# Altium project mcu.PrjPcb (part 1 of 2)
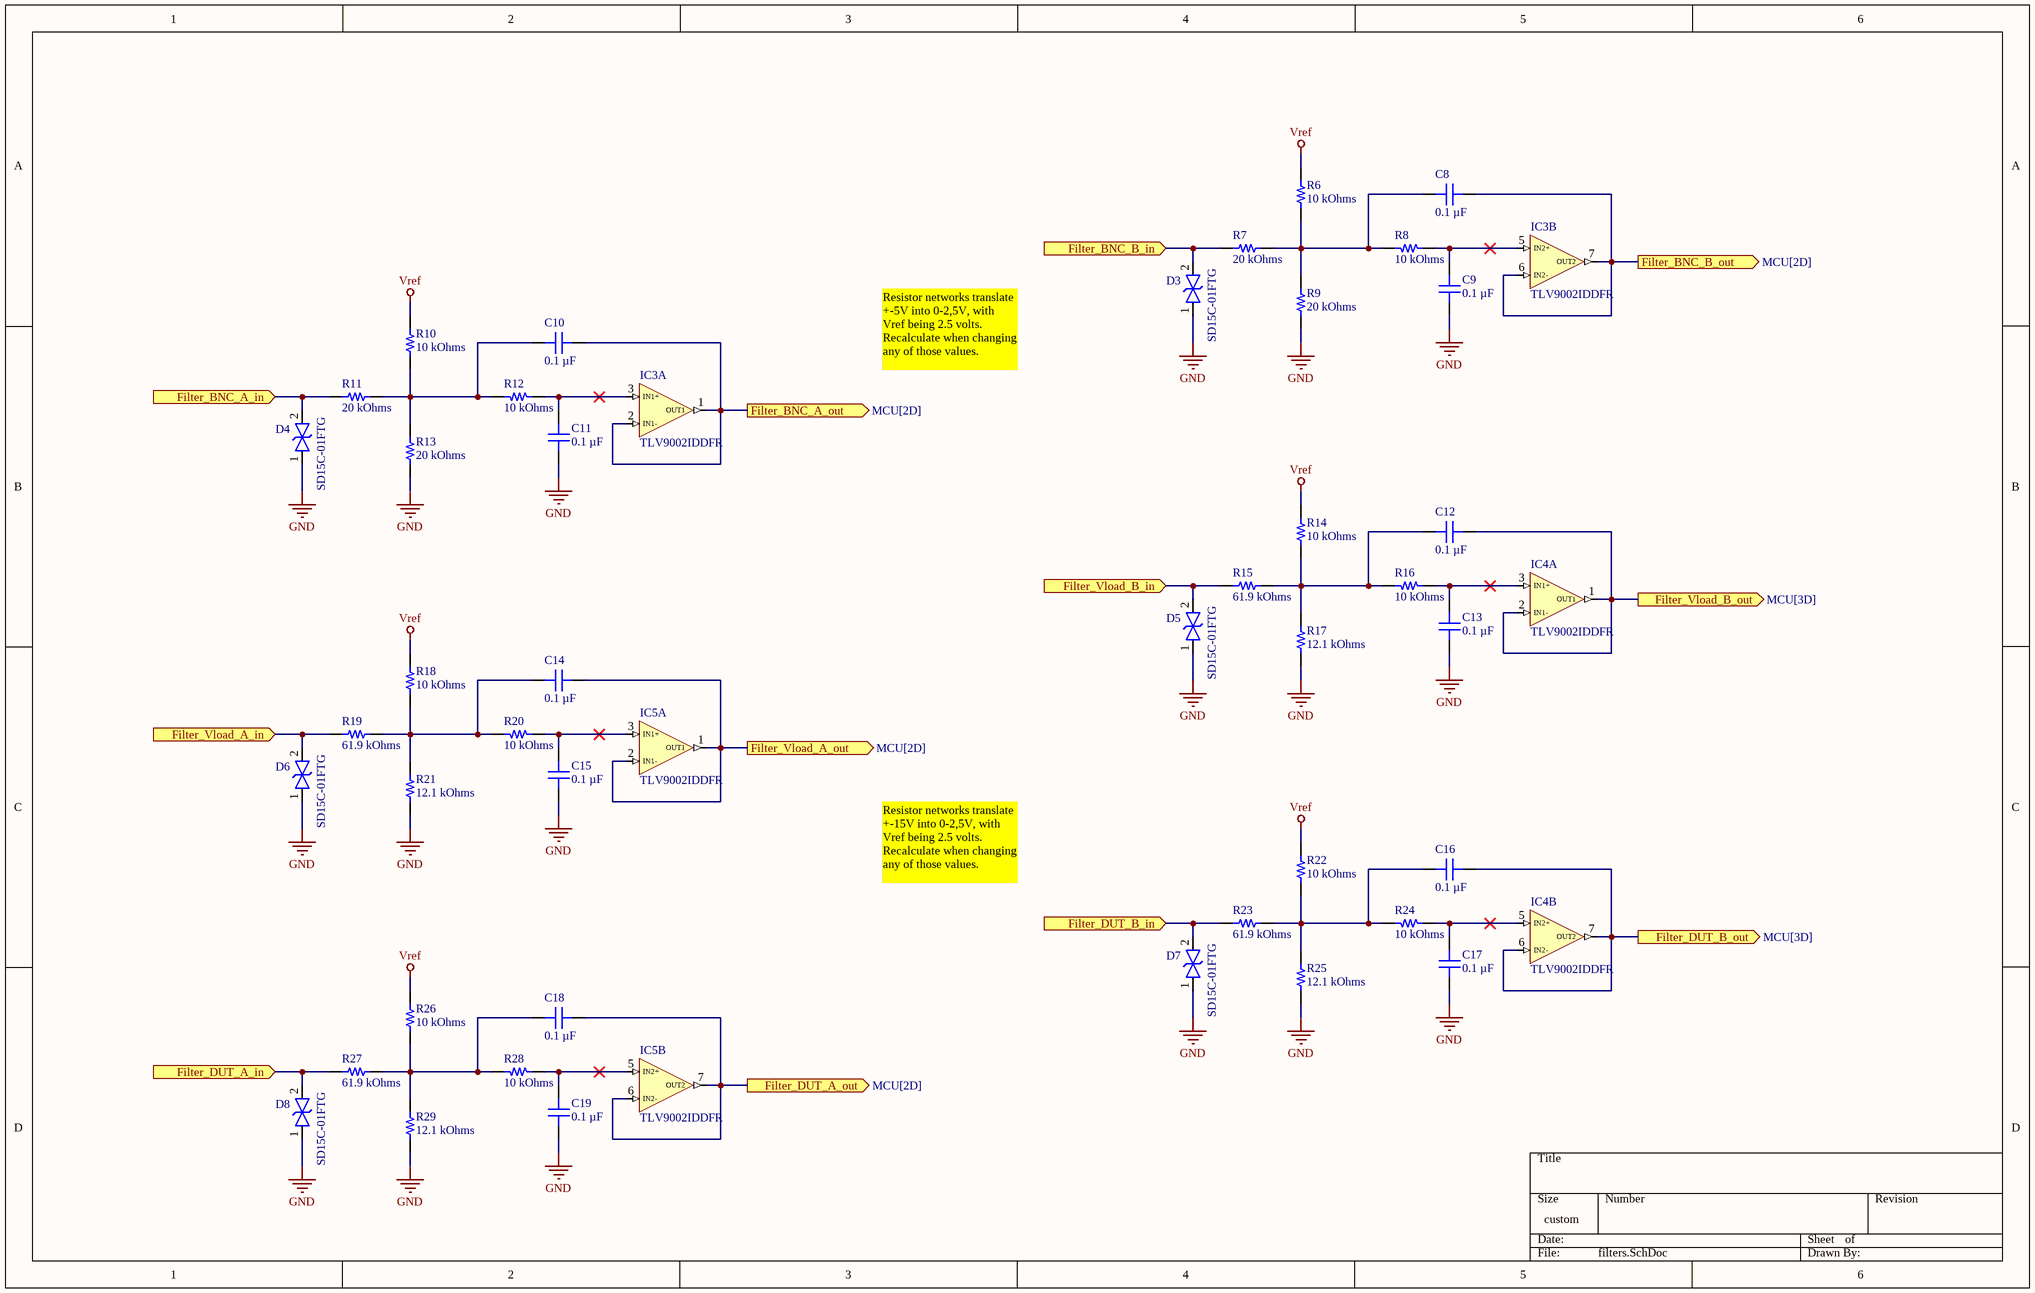
[diagram p0: filters.SchDoc]
5 sheets, 140 parts. Net scope: flat (ports and power ports of the same name join across sheets).
Board file: mcu.PcbDoc
Sheets:
  filters.SchDoc
  power.SchDoc
  MCU.SchDoc
  misc.SchDoc
  LCD.SchDoc

## Sheet filters.SchDoc
size 381 x 241 mm; SheetNumber: 1; SheetTotal: 5

### Parts
C8  0.1 µF  [CAP 1206_3216 - 0.8MM]
C9  0.1 µF  [CAP 1206_3216 - 0.8MM]
C10  0.1 µF  [CAP 1206_3216 - 0.8MM]
C11  0.1 µF  [CAP 1206_3216 - 0.8MM]
C12  0.1 µF  [CAP 1206_3216 - 0.8MM]
C13  0.1 µF  [CAP 1206_3216 - 0.8MM]
C14  0.1 µF  [CAP 1206_3216 - 0.8MM]
C15  0.1 µF  [CAP 1206_3216 - 0.8MM]
C16  0.1 µF  [CAP 1206_3216 - 0.8MM]
C17  0.1 µF  [CAP 1206_3216 - 0.8MM]
C18  0.1 µF  [CAP 1206_3216 - 0.8MM]
C19  0.1 µF  [CAP 1206_3216 - 0.8MM]
D3  SD15C-01FTG  [SD15C01FTG]
D4  SD15C-01FTG  [SD15C01FTG]
D5  SD15C-01FTG  [SD15C01FTG]
D6  SD15C-01FTG  [SD15C01FTG]
D7  SD15C-01FTG  [SD15C01FTG]
D8  SD15C-01FTG  [SD15C01FTG]
IC3  TLV9002IDDFR  [SOT65P280X110-8N]  (parts A,B of 3)
IC4  TLV9002IDDFR  [SOT65P280X110-8N]  (parts A,B of 3)
IC5  TLV9002IDDFR  [SOT65P280X110-8N]  (parts A,B of 3)
R6  10 kOhms  [RES 1206_3216]
R7  20 kOhms  [RES 1206_3216]
R8  10 kOhms  [YAGEO RES 1206_3216]
R9  20 kOhms  [RES 1206_3216]
R10  10 kOhms  [RES 1206_3216]
R11  20 kOhms  [RES 1206_3216]
R12  10 kOhms  [YAGEO RES 1206_3216]
R13  20 kOhms  [RES 1206_3216]
R14  10 kOhms  [RES 1206_3216]
R15  61.9 kOhms  [RES 1206_3216]
R16  10 kOhms  [YAGEO RES 1206_3216]
R17  12.1 kOhms  [RES 1206_3216]
R18  10 kOhms  [RES 1206_3216]
R19  61.9 kOhms  [RES 1206_3216]
R20  10 kOhms  [YAGEO RES 1206_3216]
R21  12.1 kOhms  [RES 1206_3216]
R22  10 kOhms  [RES 1206_3216]
R23  61.9 kOhms  [RES 1206_3216]
R24  10 kOhms  [YAGEO RES 1206_3216]
R25  12.1 kOhms  [RES 1206_3216]
R26  10 kOhms  [RES 1206_3216]
R27  61.9 kOhms  [RES 1206_3216]
R28  10 kOhms  [YAGEO RES 1206_3216]
R29  12.1 kOhms  [RES 1206_3216]

### Ports
Filter_BNC_A_in (in), Filter_BNC_A_out (out, see MCU[2D]), Filter_BNC_B_in (in), Filter_BNC_B_out (out, see MCU[2D]), Filter_DUT_A_in (in), Filter_DUT_A_out (out, see MCU[2D]), Filter_DUT_B_in (in), Filter_DUT_B_out (out, see MCU[3D]), Filter_Vload_A_in (in), Filter_Vload_A_out (out, see MCU[2D]), Filter_Vload_B_in (in), Filter_Vload_B_out (out, see MCU[3D])

### Nets
GND: C9.2 C11.2 C13.2 C15.2 C17.2 C19.2 D3.1 D4.1 D5.1 D6.1 D7.1 D8.1 R9.2 R13.2 R17.2 R21.2 R25.2 R29.2
Vref: R6.1 R10.1 R14.1 R18.1 R22.1 R26.1
NetC8_1: C8.1 IC3.6(IN2-) IC3.7(OUT2) ; port Filter_BNC_B_out
NetC8_2: C8.2 R6.2 R7.2 R8.2 R9.1
NetC9_1: C9.1 IC3.5(IN2+) R8.1
NetC10_1: C10.1 IC3.1(OUT1) IC3.2(IN1-) ; port Filter_BNC_A_out
NetC10_2: C10.2 R10.2 R11.2 R12.2 R13.1
NetC11_1: C11.1 IC3.3(IN1+) R12.1
NetC12_1: C12.1 IC4.1(OUT1) IC4.2(IN1-) ; port Filter_Vload_B_out
NetC12_2: C12.2 R14.2 R15.2 R16.2 R17.1
NetC13_1: C13.1 IC4.3(IN1+) R16.1
NetC14_1: C14.1 IC5.1(OUT1) IC5.2(IN1-) ; port Filter_Vload_A_out
NetC14_2: C14.2 R18.2 R19.2 R20.2 R21.1
NetC15_1: C15.1 IC5.3(IN1+) R20.1
NetC16_1: C16.1 IC4.6(IN2-) IC4.7(OUT2) ; port Filter_DUT_B_out
NetC16_2: C16.2 R22.2 R23.2 R24.2 R25.1
NetC17_1: C17.1 IC4.5(IN2+) R24.1
NetC18_1: C18.1 IC5.6(IN2-) IC5.7(OUT2) ; port Filter_DUT_A_out
NetC18_2: C18.2 R26.2 R27.2 R28.2 R29.1
NetC19_1: C19.1 IC5.5(IN2+) R28.1
NetD3_2: D3.2 R7.1 ; port Filter_BNC_B_in
NetD4_2: D4.2 R11.1 ; port Filter_BNC_A_in
NetD5_2: D5.2 R15.1 ; port Filter_Vload_B_in
NetD6_2: D6.2 R19.1 ; port Filter_Vload_A_in
NetD7_2: D7.2 R23.1 ; port Filter_DUT_B_in
NetD8_2: D8.2 R27.1 ; port Filter_DUT_A_in

### Notes on the sheet
- Resistor networks translate +-5V into 0-2,5V, with Vref being 2.5 volts. Recalculate when changing any of those values.
- Resistor networks translate +-15V into 0-2,5V, with Vref being 2.5 volts. Recalculate when changing any of those values.

### Library data of the parts
C8-C19 = 885012208087: CAP CER 0.1UF 50V X7R 1206; manufacturer: Würth Elektronik; Tolerance: ±10%; Part Number: 885012208087; Capacitance: 0.1 µF; Applications: General Purpose; componentlink1description: Datasheet; componentlink1url: https://katalog.we-online.de/pbs/datasheet/885012208087.pdf; componentlink2description: DigiKey Link; componentlink2url: https://www.digikey.com/en/products/detail/würth-elektronik/885012208087/5453982; Device Package: 1206 (3216 Metric); lastupdated: 6/4/2024 19:10:27; Lifecycle Status: Active; Minimum Order: 1; Mounting Type: Surface Mount, MLCC; Operating Temperature: -55°C ~ 125°C; Package / Case: 1206 (3216 Metric); packaging: TapeAndReel; partid: 20879; Part Status: Active; price: 0.06; series: WCAP-CSGP; Size / Dimension: 0.126" L x 0.063" W (3.20mm x 1.60mm); Supplier 1: DigiKey; Supplier Part Number 1: 732-8127-1-ND; Temperature Coefficient: X7R; Thickness (Max): 0.035" (0.90mm); value: 0.1 µF; Voltage - Rated: 50V
D3-D8 = SD15C-01FTG: TVS Diode (Bi-directional); Manufacturer_Name: LITTELFUSE; Datasheet Link: https://www.arrow.com/en/products/sd15c-01ftg/littelfuse; Height: 1.14mm; Manufacturer_Part_Number: SD15C-01FTG; Mouser Part Number: 576-SD15C-01FTG; Mouser Price/Stock: https://www.mouser.co.uk/ProductDetail/Littelfuse/SD15C-01FTG?qs=4zl93aaztU8pjSvpxpJP6g%3D%3D; Arrow Part Number: SD15C-01FTG; Arrow Price/Stock: https://www.arrow.com/en/products/sd15c-01ftg/littelfuse?region=nac
IC3-IC5 = TLV9002IDDFR: Integrated Circuit; Manufacturer_Name: Texas Instruments; Datasheet Link: https://www.ti.com/lit/gpn/TLV9002; Height: 1.1mm; Manufacturer_Part_Number: TLV9002IDDFR; Mouser Part Number: 595-TLV9002IDDFR; Mouser Price/Stock: https://www.mouser.co.uk/ProductDetail/Texas-Instruments/TLV9002IDDFR?qs=mAH9sUMRCtuVJ6NmNV%252Bgrw%3D%3D; Arrow Part Number: TLV9002IDDFR; Arrow Price/Stock: https://www.arrow.com/en/products/tlv9002iddfr/texas-instruments?utm_currency=USD&region=nac
R6 R10 R14 R18 R22 R26 = ERA-8AEB103V: RES SMD 10K OHM 0.1% 1/4W 1206; Manufacturer: Panasonic Electronic Components; Power (Watts): 0.25W, 1/4W; Temperature Coefficient: ±25ppm/°C; Part Number: ERA-8AEB103V; ComponentLink1Description: Datasheet; ComponentLink1URL: https://industrial.panasonic.com/cdbs/www-data/pdf/RDM0000/AOA0000C307.pdf; ComponentLink2Description: DigiKey Link; ComponentLink2URL: https://www.digikey.com/en/products/detail/panasonic-electronic-components/ERA-8AEB103V/3070742; Composition: Thin Film; Device Package: 1206 (3216 Metric); Features: Automotive AEC-Q200; Height - Seated (Max): 0.028" (0.70mm); LastUpdated: 2/9/2024 20:54:17; Lifecycle Status: Active; Minimum Order: 1; Number of Terminations: 2; Operating Temperature: -55°C ~ 155°C; Package / Case: 1206 (3216 Metric); Packaging: TapeAndReel; PartId: 33990; Part Status: Active; Price: 0.10; Ratings: AEC-Q200; Resistance: 10 kOhms; Series: ERA-8A; Size / Dimension: 0.126" L x 0.063" W (3.20mm x 1.60mm); Supplier 1: DigiKey; Supplier Part Number 1: P10KBCCT-ND; Supplier Device Package: 1206; Tolerance: ±0.1%; Value: 10 kOhms
R7 R9 R11 R13 = ERA-8AEB203V: RES SMD 20K OHM 0.1% 1/4W 1206; Manufacturer: Panasonic Electronic Components; Power (Watts): 0.25W, 1/4W; Temperature Coefficient: ±25ppm/°C; Part Number: ERA-8AEB203V; ComponentLink1Description: Datasheet; ComponentLink1URL: https://industrial.panasonic.com/cdbs/www-data/pdf/RDM0000/AOA0000C307.pdf; ComponentLink2Description: DigiKey Link; ComponentLink2URL: https://www.digikey.com/en/products/detail/panasonic-electronic-components/ERA-8AEB203V/3070867; Composition: Thin Film; Device Package: 1206 (3216 Metric); Features: Automotive AEC-Q200; Height - Seated (Max): 0.028" (0.70mm); LastUpdated: 2/9/2024 20:54:17; Lifecycle Status: Active; Minimum Order: 1; Number of Terminations: 2; Operating Temperature: -55°C ~ 155°C; Package / Case: 1206 (3216 Metric); Packaging: TapeAndReel; PartId: 33988; Part Status: Active; Price: 0.10; Ratings: AEC-Q200; Resistance: 20 kOhms; Series: ERA-8A; Size / Dimension: 0.126" L x 0.063" W (3.20mm x 1.60mm); Supplier 1: DigiKey; Supplier Part Number 1: P20KBCCT-ND; Supplier Device Package: 1206; Tolerance: ±0.1%; Value: 20 kOhms
R8 R12 R16 R20 R24 R28 = RT1206FRE0710KL: RES SMD 10K OHM 1% 1/4W 1206; Manufacturer: Yageo; Power (Watts): 0.25W, 1/4W; Temperature Coefficient: ±50ppm/°C; Part Number: RT1206FRE0710KL; ComponentLink1Description: Datasheet; ComponentLink1URL: https://www.yageo.com/upload/media/product/productsearch/datasheet/rchip/PYu-RT_1-to-0.01_RoHS_L_11.pdf; ComponentLink2Description: DigiKey Link; ComponentLink2URL: https://www.digikey.com/en/products/detail/yageo/RT1206FRE0710KL/1082868; Composition: Thin Film; Device Package: 1206 (3216 Metric); Height - Seated (Max): 0.026" (0.65mm); LastUpdated: 7/25/2024 09:21:28; Lifecycle Status: Active; Minimum Order: 1; Number of Terminations: 2; Operating Temperature: -55°C ~ 155°C; Package / Case: 1206 (3216 Metric); Packaging: TapeAndReel; PartId: 38903; Part Status: Active; Price: 0.01; Resistance: 10 kOhms; Series: RT; Size / Dimension: 0.122" L x 0.063" W (3.10mm x 1.60mm); Supplier 1: DigiKey; Supplier Part Number 1: YAG1242CT-ND; Supplier Device Package: 1206; Tolerance: ±1%; Value: 10 kOhms
R15 R19 R23 R27 = ERA-8AEB6192V: RES SMD 61.9K OHM 0.1% 1/4W 1206; Manufacturer: Panasonic Electronic Components; Power (Watts): 0.25W, 1/4W; Temperature Coefficient: ±25ppm/°C; Part Number: ERA-8AEB6192V; ComponentLink1Description: Datasheet; ComponentLink1URL: https://industrial.panasonic.com/cdbs/www-data/pdf/RDM0000/AOA0000C307.pdf; ComponentLink2Description: DigiKey Link; ComponentLink2URL: https://www.digikey.com/en/products/detail/panasonic-electronic-components/ERA-8AEB6192V/3071114; Composition: Thin Film; Device Package: 1206 (3216 Metric); Features: Automotive AEC-Q200; Height - Seated (Max): 0.028" (0.70mm); LastUpdated: 2/9/2024 20:53:52; Lifecycle Status: Active; Minimum Order: 1; Number of Terminations: 2; Operating Temperature: -55°C ~ 155°C; Package / Case: 1206 (3216 Metric); Packaging: TapeAndReel; PartId: 41065; Part Status: Active; Price: 0.10; Ratings: AEC-Q200; Resistance: 61.9 kOhms; Series: ERA-8A; Size / Dimension: 0.126" L x 0.063" W (3.20mm x 1.60mm); Supplier 1: DigiKey; Supplier Part Number 1: P61.9KBCCT-ND; Supplier Device Package: 1206; Tolerance: ±0.1%; Value: 61.9 kOhms
R17 R21 R25 R29 = ERA-8AEB1212V: RES SMD 12.1K OHM 0.1% 1/4W 1206; Manufacturer: Panasonic Electronic Components; Power (Watts): 0.25W, 1/4W; Temperature Coefficient: ±25ppm/°C; Part Number: ERA-8AEB1212V; ComponentLink1Description: Datasheet; ComponentLink1URL: https://industrial.panasonic.com/cdbs/www-data/pdf/RDM0000/AOA0000C307.pdf; ComponentLink2Description: DigiKey Link; ComponentLink2URL: https://www.digikey.com/en/products/detail/panasonic-electronic-components/ERA-8AEB1212V/3070771; Composition: Thin Film; Device Package: 1206 (3216 Metric); Features: Automotive AEC-Q200; Height - Seated (Max): 0.028" (0.70mm); LastUpdated: 2/9/2024 20:54:30; Lifecycle Status: Active; Minimum Order: 1; Number of Terminations: 2; Operating Temperature: -55°C ~ 155°C; Package / Case: 1206 (3216 Metric); Packaging: TapeAndReel; PartId: 30396; Part Status: Active; Price: 0.10; Ratings: AEC-Q200; Resistance: 12.1 kOhms; Series: ERA-8A; Size / Dimension: 0.126" L x 0.063" W (3.20mm x 1.60mm); Supplier 1: DigiKey; Supplier Part Number 1: 10-ERA-8AEB1212VCT-ND; Supplier Device Package: 1206; Tolerance: ±0.1%; Value: 12.1 kOhms

## Sheet power.SchDoc
size 381 x 241 mm; SheetNumber: 2; SheetTotal: 5
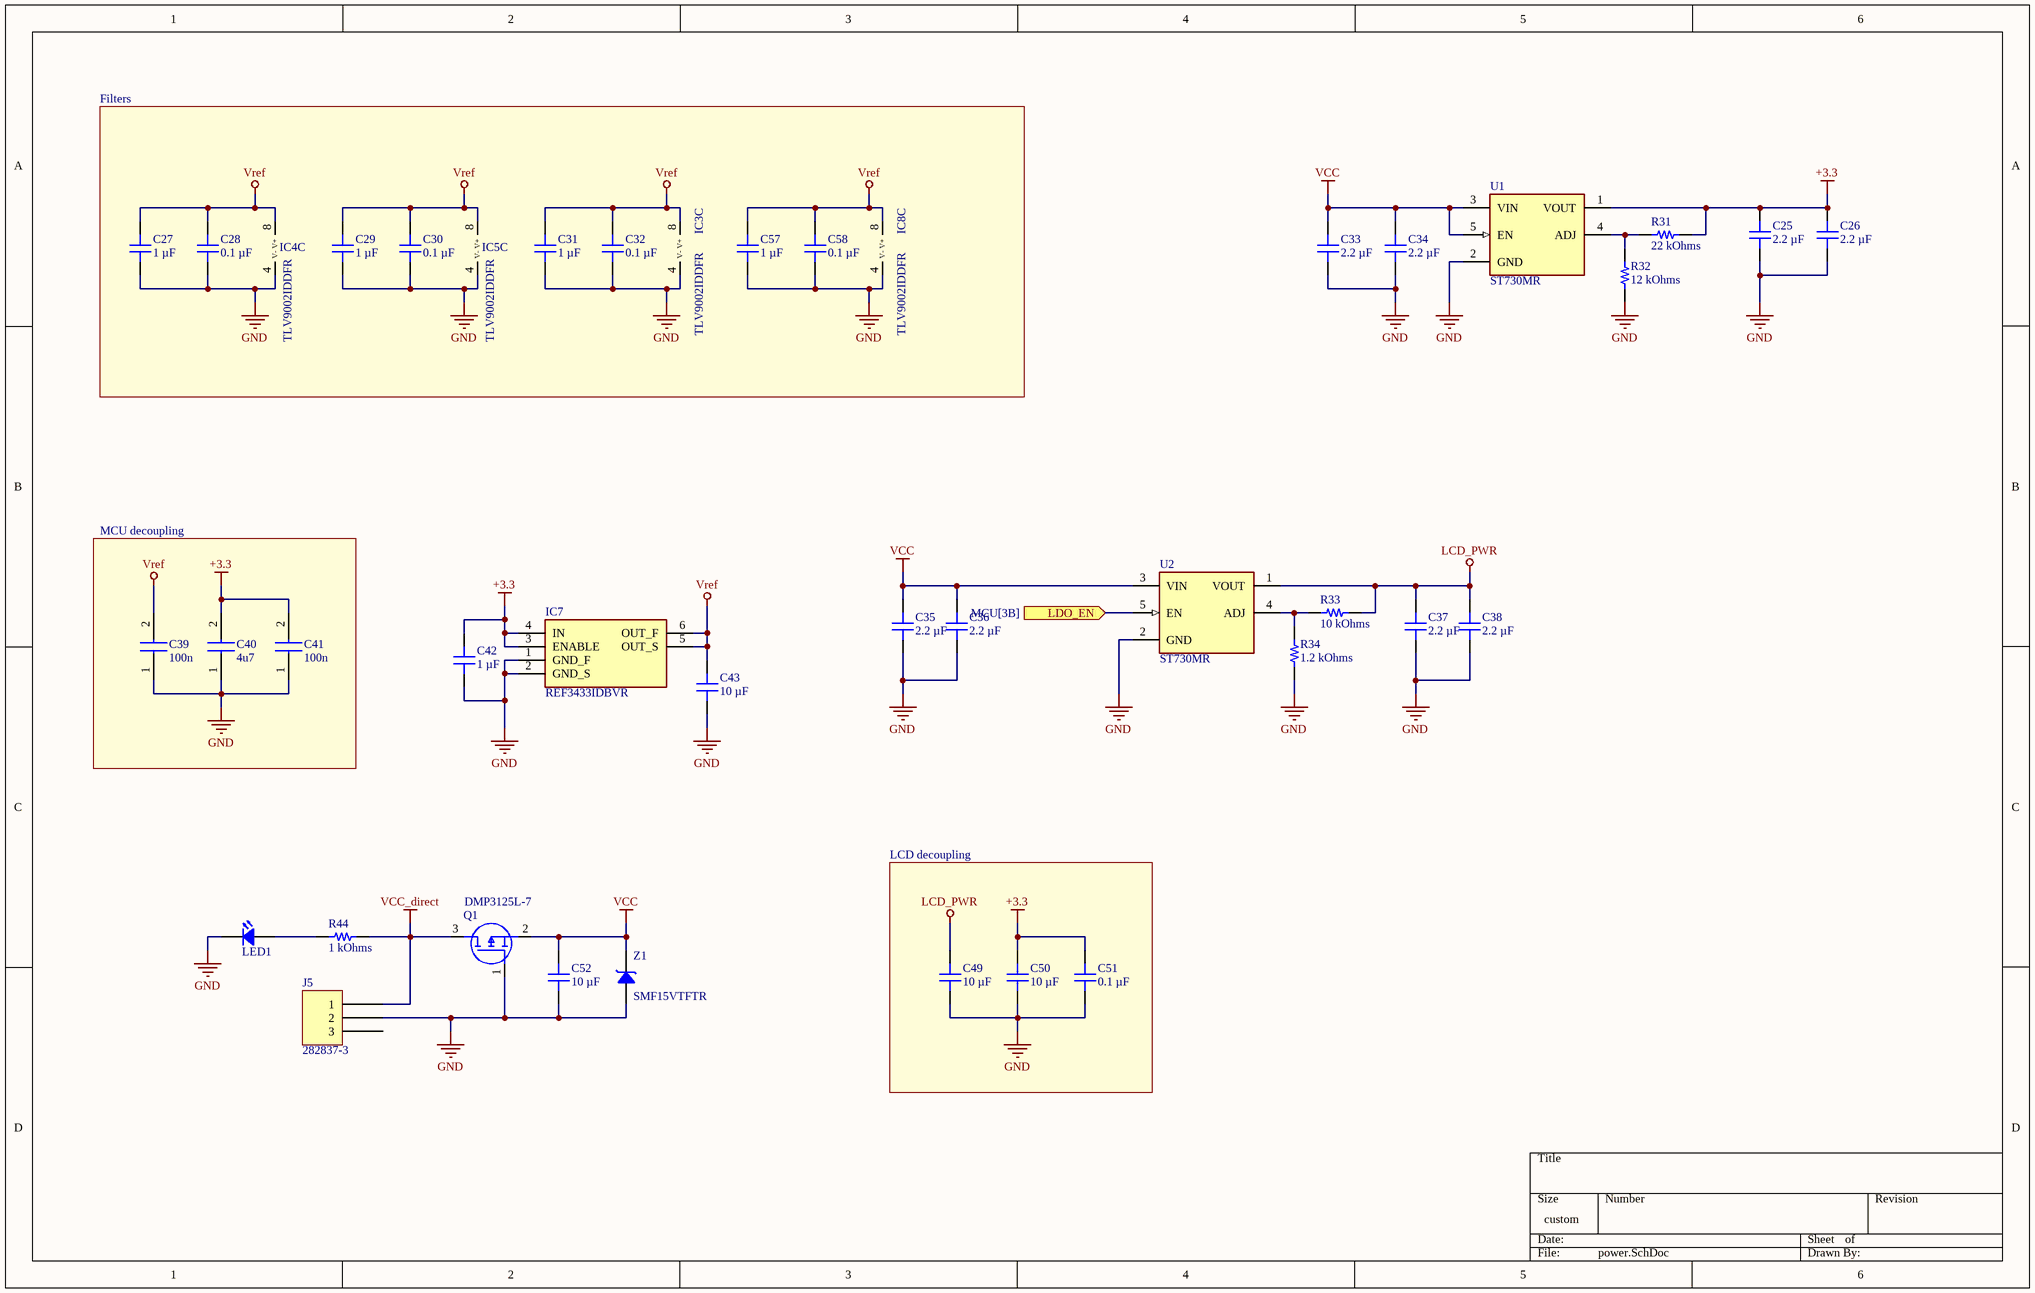
[diagram p1: power.SchDoc]

### Parts
C25  2.2 µF  [CAP 1206_3216 - 0.8MM]
C26  2.2 µF  [CAP 1206_3216 - 0.8MM]
C27  1 µF  [CAP 1206_3216 - 0.8MM]
C28  0.1 µF  [CAP 1206_3216 - 0.8MM]
C29  1 µF  [CAP 1206_3216 - 0.8MM]
C30  0.1 µF  [CAP 1206_3216 - 0.8MM]
C31  1 µF  [CAP 1206_3216 - 0.8MM]
C32  0.1 µF  [CAP 1206_3216 - 0.8MM]
C33  2.2 µF  [CAP 1206_3216 - 0.8MM]
C34  2.2 µF  [CAP 1206_3216 - 0.8MM]
C35  2.2 µF  [CAP 1206_3216 - 0.8MM]
C36  2.2 µF  [CAP 1206_3216 - 0.8MM]
C37  2.2 µF  [CAP 1206_3216 - 0.8MM]
C38  2.2 µF  [CAP 1206_3216 - 0.8MM]
C39  100n  [C0805]
C40  4u7  [C0805]
C41  100n  [C0805]
C42  1 µF  [CAP 1206_3216 - 0.8MM]
C43  10 µF  [CAP 1206_3216 - 0.8MM]
C49  10 µF  [CAP 1206_3216 - 0.8MM]
C50  10 µF  [CAP 1206_3216 - 0.8MM]
C51  0.1 µF  [CAP 1206_3216 - 0.8MM]
C52  10 µF  [CAP 1206_3216 - 0.8MM]
C57  1 µF  [CAP 1206_3216 - 0.8MM]
C58  0.1 µF  [CAP 1206_3216 - 0.8MM]
IC3  TLV9002IDDFR  [SOT65P280X110-8N]  (part C of 3)
IC4  TLV9002IDDFR  [SOT65P280X110-8N]  (part C of 3)
IC5  TLV9002IDDFR  [SOT65P280X110-8N]  (part C of 3)
IC7  REF3433IDBVR  [SOT95P280X145-6N]
IC8  TLV9002IDDFR  [SOT65P280X110-8N]  (part C of 3)
J5  282837-3  [TE 282837-3]
LED1  KR_EELP41.22-Q1S1-36-A8J8-020-R18  [KREELP4122Q1S136A8J8020R18]  (value not drawn)
Q1  DMP3125L-7  [SOT96P240X110-3N]
R31  22 kOhms  [YAGEO RES 1206_3216]
R32  12 kOhms  [YAGEO RES 1206_3216]
R33  10 kOhms  [YAGEO RES 1206_3216]
R34  1.2 kOhms  [YAGEO RES 1206_3216]
R44  1 kOhms  [YAGEO RES 1206_3216]
U1  ST730MR  [FP-UJ-5-IPC_B]
U2  ST730MR  [FP-UJ-5-IPC_B]
Z1  SMF15VTFTR  [SMF15VTFTR]

### Blocks framed on the sheet
Filters: C27-C32 C57 C58 IC3-IC5 IC8
MCU decoupling: C39-C41
LCD decoupling: C49-C51

### Ports
LDO_EN (in, see MCU[3B])

### Nets
+3.3: C25.2 C26.2 C40.2 C41.2 C42.2 C50.2 C51.2 IC7.3(ENABLE) IC7.4(IN) R31.2 U1.1(VOUT)
GND: C25.1 C26.1 C27.1 C28.1 C29.1 C30.1 C31.1 C32.1 C33.1 C34.1 C35.1 C36.1 C37.1 C38.1 C39.1 C40.1 C41.1 C42.1 C43.1 C49.1 C50.1 C51.1 C52.1 C57.1 C58.1 IC3.4(V-) IC4.4(V-) IC5.4(V-) IC7.1(GND_F) IC7.2(GND_S) IC8.4(V-) J5.2 LED1.1(K) Q1.1(G) R32.2 R34.2 U1.2(GND) U2.2(GND) Z1.2
LCD_PWR: C37.2 C38.2 C49.2 R33.2 U2.1(VOUT)
VCC: C33.2 C34.2 C35.2 C36.2 C52.2 Q1.2(S) U1.3(VIN) U1.5(EN) U2.3(VIN) Z1.1
VCC_direct: J5.1 Q1.3(D) R44.1
Vref: C27.2 C28.2 C29.2 C30.2 C31.2 C32.2 C39.2 C43.2 C57.2 C58.2 IC3.8(V+) IC4.8(V+) IC5.8(V+) IC7.5(OUT_S) IC7.6(OUT_F) IC8.8(V+)
NetIC1_34: U2.5(EN) ; port LDO_EN
NetLED1_2: LED1.2(A) R44.2
NetR31_1: R31.1 R32.1 U1.4(ADJ)
NetR33_1: R33.1 R34.1 U2.4(ADJ)

Not connected (* = marked no-connect by the designer): J5 3

### Library data of the parts
C25 C26 C33-C38 = 885382208001: CAP CER 2.2UF 25V X7R 1206; manufacturer: Würth Elektronik; Tolerance: ±10%; Part Number: 885382208001; Capacitance: 2.2 µF; Applications: Boardflex Sensitive; componentlink2description: DigiKey Link; componentlink2url: https://www.digikey.com/en/products/detail/würth-elektronik/885382208001/9816354; Device Package: 1206 (3216 Metric); Features: Soft Termination; lastupdated: 6/4/2024 19:10:38; Lifecycle Status: Active; Minimum Order: 1; Mounting Type: Surface Mount, MLCC; Operating Temperature: -55°C ~ 125°C; Package / Case: 1206 (3216 Metric); packaging: TapeAndReel; partid: 45904; Part Status: Active; price: 0.35; series: WCAP-CSST; Size / Dimension: 0.126" L x 0.063" W (3.20mm x 1.60mm); Supplier 1: DigiKey; Supplier Part Number 1: 732-13199-1-ND; Temperature Coefficient: X7R; Thickness (Max): 0.083" (2.10mm); value: 2.2 µF; Voltage - Rated: 25V
C27 C29 C31 C42 C57 = 885012208093: CAP CER 1UF 50V X7R 1206; manufacturer: Würth Elektronik; Tolerance: ±10%; Part Number: 885012208093; Capacitance: 1 µF; Applications: General Purpose; componentlink1description: Datasheet; componentlink1url: https://katalog.we-online.de/pbs/datasheet/885012208093.pdf; componentlink2description: DigiKey Link; componentlink2url: https://www.digikey.com/en/products/detail/würth-elektronik/885012208093/5453432; Device Package: 1206 (3216 Metric); lastupdated: 6/4/2024 19:10:33; Lifecycle Status: Active; Minimum Order: 1; Mounting Type: Surface Mount, MLCC; Operating Temperature: -55°C ~ 125°C; Package / Case: 1206 (3216 Metric); packaging: TapeAndReel; partid: 39665; Part Status: Active; price: 0.10; series: WCAP-CSGP; Size / Dimension: 0.126" L x 0.063" W (3.20mm x 1.60mm); Supplier 1: DigiKey; Supplier Part Number 1: 732-7577-1-ND; Temperature Coefficient: X7R; Thickness (Max): 0.075" (1.90mm); value: 1 µF; Voltage - Rated: 50V
C28 C30 C32 C51 C58 = 885012208087: as C8 on sheet filters; Part Number: 885012208087; Capacitance: 0.1 µF; Applications: General Purpose; componentlink1description: Datasheet; componentlink1url: https://katalog.we-online.de/pbs/datasheet/885012208087.pdf; componentlink2description: DigiKey Link; componentlink2url: https://www.digikey.com/en/products/detail/würth-elektronik/885012208087/5453982; Device Package: 1206 (3216 Metric); lastupdated: 6/4/2024 19:10:27; Lifecycle Status: Active; Minimum Order: 1; Mounting Type: Surface Mount, MLCC; Operating Temperature: -55°C ~ 125°C; Package / Case: 1206 (3216 Metric); packaging: TapeAndReel; partid: 20879; Part Status: Active; price: 0.06; series: WCAP-CSGP; Size / Dimension: 0.126" L x 0.063" W (3.20mm x 1.60mm); Supplier 1: DigiKey; Supplier Part Number 1: 732-8127-1-ND; Temperature Coefficient: X7R; Thickness (Max): 0.035" (0.90mm); value: 0.1 µF; Voltage - Rated: 50V
C39 C41 = C0805C104K3RACTU: Capacitor; Manufacturer_Name: KEMET; Datasheet Link: https://content.kemet.com/datasheets/KEM_C1002_X7R_SMD.pdf; Height: 1.1mm; Manufacturer_Part_Number: C0805C104K3RACTU; Mouser Part Number: 80-C0805C104K3R; Mouser Price/Stock: https://www.mouser.co.uk/ProductDetail/KEMET/C0805C104K3RACTU?qs=zZwvocWqSRjmUvfNxkIN%2Fg%3D%3D; Arrow Part Number: C0805C104K3RACTU; Arrow Price/Stock: https://www.arrow.com/en/products/c0805c104k3ractu/kemet-corporation
C40 = C0805C475K9PAC: Capacitor; Manufacturer_Name: KEMET; Datasheet Link: https://componentsearchengine.com/Datasheets/2/C0805C475K8RACTU.pdf; Height: 1.4mm; Manufacturer_Part_Number: C0805C475K9PAC; Mouser Part Number: 80-C0805C475K9PAC; Mouser Price/Stock: https://www.mouser.co.uk/ProductDetail/KEMET/C0805C475K9PAC?qs=AHS6Mz2dKxNT7foClPNFpA%3D%3D; Arrow Part Number: C0805C475K9PAC; Arrow Price/Stock: https://www.arrow.com/en/products/c0805c475k9pac/kemet-corporation?region=nac
C43 C49 C50 C52 = 885012208069: CAP CER 10UF 25V X7R 1206; manufacturer: Würth Elektronik; Tolerance: ±10%; Part Number: 885012208069; Capacitance: 10 µF; Applications: General Purpose; componentlink1description: Datasheet; componentlink1url: https://katalog.we-online.de/pbs/datasheet/885012208069.pdf; componentlink2description: DigiKey Link; componentlink2url: https://www.digikey.com/en/products/detail/würth-elektronik/885012208069/5453429; Device Package: 1206 (3216 Metric); lastupdated: 6/4/2024 19:10:32; Lifecycle Status: Active; Minimum Order: 1; Mounting Type: Surface Mount, MLCC; Operating Temperature: -55°C ~ 125°C; Package / Case: 1206 (3216 Metric); packaging: TapeAndReel; partid: 43199; Part Status: Active; price: 0.40; series: WCAP-CSGP; Size / Dimension: 0.126" L x 0.063" W (3.20mm x 1.60mm); Supplier 1: DigiKey; Supplier Part Number 1: 732-7574-1-ND; Temperature Coefficient: X7R; Thickness (Max): 0.075" (1.90mm); value: 10 µF; Voltage - Rated: 25V
IC3-IC5 IC8 = TLV9002IDDFR: as IC3 on sheet filters; Datasheet Link: https://www.ti.com/lit/gpn/TLV9002; Height: 1.1mm; Manufacturer_Part_Number: TLV9002IDDFR; Mouser Part Number: 595-TLV9002IDDFR; Mouser Price/Stock: https://www.mouser.co.uk/ProductDetail/Texas-Instruments/TLV9002IDDFR?qs=mAH9sUMRCtuVJ6NmNV%252Bgrw%3D%3D; Arrow Part Number: TLV9002IDDFR; Arrow Price/Stock: https://www.arrow.com/en/products/tlv9002iddfr/texas-instruments?utm_currency=USD&region=nac
IC7 = REF3433IDBVR: Integrated Circuit; Manufacturer_Name: Texas Instruments; Datasheet Link: http://www.ti.com/lit/ds/symlink/ref3433.pdf; Height: 1.45mm; Manufacturer_Part_Number: REF3433IDBVR; Mouser Part Number: 595-REF3433IDBVR; Mouser Price/Stock: https://www.mouser.co.uk/ProductDetail/Texas-Instruments/REF3433IDBVR?qs=W0yvOO0ixfGBJPqcMgjPbw%3D%3D; Arrow Part Number: REF3433IDBVR; Arrow Price/Stock: https://www.arrow.com/en/products/ref3433idbvr/texas-instruments?utm_currency=USD&region=nac
J5 = 282837-3: TERM BLK 3P SIDE ENT 5.08MM PCB; Manufacturer: TE Connectivity AMP Connectors; Current: 13.5 A; Mating Orientation: Horizontal with Board; Number of Levels: 1; Pitch: 0.200" (5.08mm); Positions Per Level: 3; Voltage: 300 V; Wire Gauge: 16-28 AWG; Wire Termination: Screw - Rising Cage Clamp; Part Number: 282837-3; Color: Green; ComponentLink1Description: Datasheet; ComponentLink1URL: https://www.te.com/commerce/DocumentDelivery/DDEController?Action=srchrtrv&DocNm=282837&DocType=Customer+Drawing&DocLang=English; ComponentLink2Description: DigiKey Link; ComponentLink2URL: https://www.digikey.com/en/products/detail/te-connectivity-amp-connectors/282837-3/2187974; Features: Interlocking (Side); LastUpdated: 6/21/2022 15:00:39; Lifecycle Status: Active; Minimum Order: 1; Mounting Type: Through Hole; Packaging: Tray; Part Status: Active; Price: 0.47; Series: Buchanan; Supplier 1: DigiKey; Supplier Part Number 1: A113321-ND
LED1 = KR_EELP41.22-Q1S1-36-A8J8-020-R18: LED; Manufacturer_Name: ams OSRAM; Manufacturer_Part_Number: KR EELP41.22-Q1S1-36-A8J8-020-R18; Datasheet Link: https://look.ams-osram.com/m/7eda7e8e2ca21691/original/KR-EELP41-22.pdf; Height: 0.5mm; Mouser Part Number: 720-P412Q1S136A8J802; Mouser Price/Stock: https://www.mouser.co.uk/ProductDetail/ams-OSRAM/KR-EELP41.22-Q1S1-36-A8J8-020-R18?qs=ZcfC38r4PouTxNZSRl%252Bn6g%3D%3D
Q1 = DMP3125L-7: MOSFET (P-Channel); Manufacturer_Name: Diodes Incorporated; Datasheet Link: https://www.diodes.com//assets/Datasheets/DMP3125L.pdf; Height: 1.1mm; Manufacturer_Part_Number: DMP3125L-7; Mouser Part Number: 621-DMP3125L-7; Mouser Price/Stock: https://www.mouser.co.uk/ProductDetail/Diodes-Incorporated/DMP3125L-7?qs=W0yvOO0ixfH8ma8MdHfXQA%3D%3D; Arrow Part Number: DMP3125L-7; Arrow Price/Stock: https://www.arrow.com/en/products/dmp3125l-7/diodes-incorporated?region=nac
R31 = RT1206FRE0722KL: RES SMD 22K OHM 1% 1/4W 1206; Manufacturer: Yageo; Power (Watts): 0.25W, 1/4W; Temperature Coefficient: ±50ppm/°C; Part Number: RT1206FRE0722KL; ComponentLink1Description: Datasheet; ComponentLink1URL: https://www.yageo.com/upload/media/product/productsearch/datasheet/rchip/PYu-RT_1-to-0.01_RoHS_L_12.pdf; ComponentLink2Description: DigiKey Link; ComponentLink2URL: https://www.digikey.com/en/products/detail/yageo/RT1206FRE0722KL/1083042; Composition: Thin Film; Device Package: 1206 (3216 Metric); Height - Seated (Max): 0.026" (0.65mm); LastUpdated: 7/25/2024 09:21:19; Lifecycle Status: Active; Minimum Order: 1; Number of Terminations: 2; Operating Temperature: -55°C ~ 155°C; Package / Case: 1206 (3216 Metric); Packaging: TapeAndReel; PartId: 69172; Price: 0.01; Resistance: 22 kOhms; Series: RT; Size / Dimension: 0.122" L x 0.063" W (3.10mm x 1.60mm); Supplier 1: DigiKey; Supplier Part Number 1: 13-RT1206FRE0722KLCT-ND; Supplier Device Package: 1206; Tolerance: ±1%; Value: 22 kOhms; Part Status: Active
R32 = RT1206FRE0712KL: RES SMD 12K OHM 1% 1/4W 1206; Manufacturer: Yageo; Power (Watts): 0.25W, 1/4W; Temperature Coefficient: ±50ppm/°C; Part Number: RT1206FRE0712KL; ComponentLink1Description: Datasheet; ComponentLink1URL: https://www.yageo.com/upload/media/product/productsearch/datasheet/rchip/PYu-RT_1-to-0.01_RoHS_L_12.pdf; ComponentLink2Description: DigiKey Link; ComponentLink2URL: https://www.digikey.com/en/products/detail/yageo/RT1206FRE0712KL/1082900; Composition: Thin Film; Device Package: 1206 (3216 Metric); Height - Seated (Max): 0.026" (0.65mm); LastUpdated: 7/25/2024 09:21:22; Lifecycle Status: Active; Minimum Order: 1; Number of Terminations: 2; Operating Temperature: -55°C ~ 155°C; Package / Case: 1206 (3216 Metric); Packaging: TapeAndReel; PartId: 58377; Part Status: Active; Price: 0.01; Resistance: 12 kOhms; Series: RT; Size / Dimension: 0.122" L x 0.063" W (3.10mm x 1.60mm); Supplier 1: DigiKey; Supplier Part Number 1: 13-RT1206FRE0712KLCT-ND; Supplier Device Package: 1206; Tolerance: ±1%; Value: 12 kOhms
R33 = RT1206FRE0710KL: as R8 on sheet filters; Part Number: RT1206FRE0710KL; ComponentLink1Description: Datasheet; ComponentLink1URL: https://www.yageo.com/upload/media/product/productsearch/datasheet/rchip/PYu-RT_1-to-0.01_RoHS_L_11.pdf; ComponentLink2Description: DigiKey Link; ComponentLink2URL: https://www.digikey.com/en/products/detail/yageo/RT1206FRE0710KL/1082868; Composition: Thin Film; Device Package: 1206 (3216 Metric); Height - Seated (Max): 0.026" (0.65mm); LastUpdated: 7/25/2024 09:21:28; Lifecycle Status: Active; Minimum Order: 1; Number of Terminations: 2; Operating Temperature: -55°C ~ 155°C; Package / Case: 1206 (3216 Metric); Packaging: TapeAndReel; PartId: 38903; Part Status: Active; Price: 0.01; Resistance: 10 kOhms; Series: RT; Size / Dimension: 0.122" L x 0.063" W (3.10mm x 1.60mm); Supplier 1: DigiKey; Supplier Part Number 1: YAG1242CT-ND; Supplier Device Package: 1206; Tolerance: ±1%; Value: 10 kOhms
R34 = RT1206FRE071K2L: RES SMD 1.2K OHM 1% 1/4W 1206; Manufacturer: Yageo; Power (Watts): 0.25W, 1/4W; Temperature Coefficient: ±50ppm/°C; Part Number: RT1206FRE071K2L; ComponentLink1Description: Datasheet; ComponentLink1URL: https://www.yageo.com/upload/media/product/productsearch/datasheet/rchip/PYu-RT_1-to-0.01_RoHS_L_12.pdf; ComponentLink2Description: DigiKey Link; ComponentLink2URL: https://www.digikey.com/en/products/detail/yageo/RT1206FRE071K2L/1082995; Composition: Thin Film; Device Package: 1206 (3216 Metric); Height - Seated (Max): 0.026" (0.65mm); LastUpdated: 7/25/2024 09:21:22; Lifecycle Status: Active; Minimum Order: 1; Number of Terminations: 2; Operating Temperature: -55°C ~ 155°C; Package / Case: 1206 (3216 Metric); Packaging: TapeAndReel; PartId: 58383; Part Status: Active; Price: 0.01; Resistance: 1.2 kOhms; Series: RT; Size / Dimension: 0.122" L x 0.063" W (3.10mm x 1.60mm); Supplier 1: DigiKey; Supplier Part Number 1: 13-RT1206FRE071K2LCT-ND; Supplier Device Package: 1206; Tolerance: ±1%; Value: 1.2 kOhms
R44 = RT1206FRE071KL: RES SMD 1K OHM 1% 1/4W 1206; Manufacturer: Yageo; Power (Watts): 0.25W, 1/4W; Temperature Coefficient: ±50ppm/°C; Part Number: RT1206FRE071KL; ComponentLink1Description: Datasheet; ComponentLink1URL: https://www.yageo.com/upload/media/product/productsearch/datasheet/rchip/PYu-RT_1-to-0.01_RoHS_L_11.pdf; ComponentLink2Description: DigiKey Link; ComponentLink2URL: https://www.digikey.com/en/products/detail/yageo/RT1206FRE071KL/1083016; Composition: Thin Film; Device Package: 1206 (3216 Metric); Height - Seated (Max): 0.026" (0.65mm); LastUpdated: 7/25/2024 09:21:27; Lifecycle Status: Active; Minimum Order: 1; Number of Terminations: 2; Operating Temperature: -55°C ~ 155°C; Package / Case: 1206 (3216 Metric); Packaging: TapeAndReel; PartId: 40465; Part Status: Active; Price: 0.01; Resistance: 1 kOhms; Series: RT; Size / Dimension: 0.122" L x 0.063" W (3.10mm x 1.60mm); Supplier 1: DigiKey; Supplier Part Number 1: YAG3366CT-ND; Supplier Device Package: 1206; Tolerance: ±1%; Value: 1 kOhms
Z1 = SMF15VTFTR: Zener Diode; Manufacturer_Name: ROHM Semiconductor; Datasheet Link: https://fscdn.rohm.com/en/products/databook/datasheet/discrete/diode/zener/smf15vtftr-e.pdf; Height: 0.9mm; Manufacturer_Part_Number: SMF15VTFTR; Mouser Part Number: 755-SMF15VTFTR; Mouser Price/Stock: https://www.mouser.co.uk/ProductDetail/ROHM-Semiconductor/SMF15VTFTR?qs=HXFqYaX1Q2wU8NS9uLe0xg%3D%3D

## Sheet MCU.SchDoc
size A; SheetNumber: 3; SheetTotal: 5
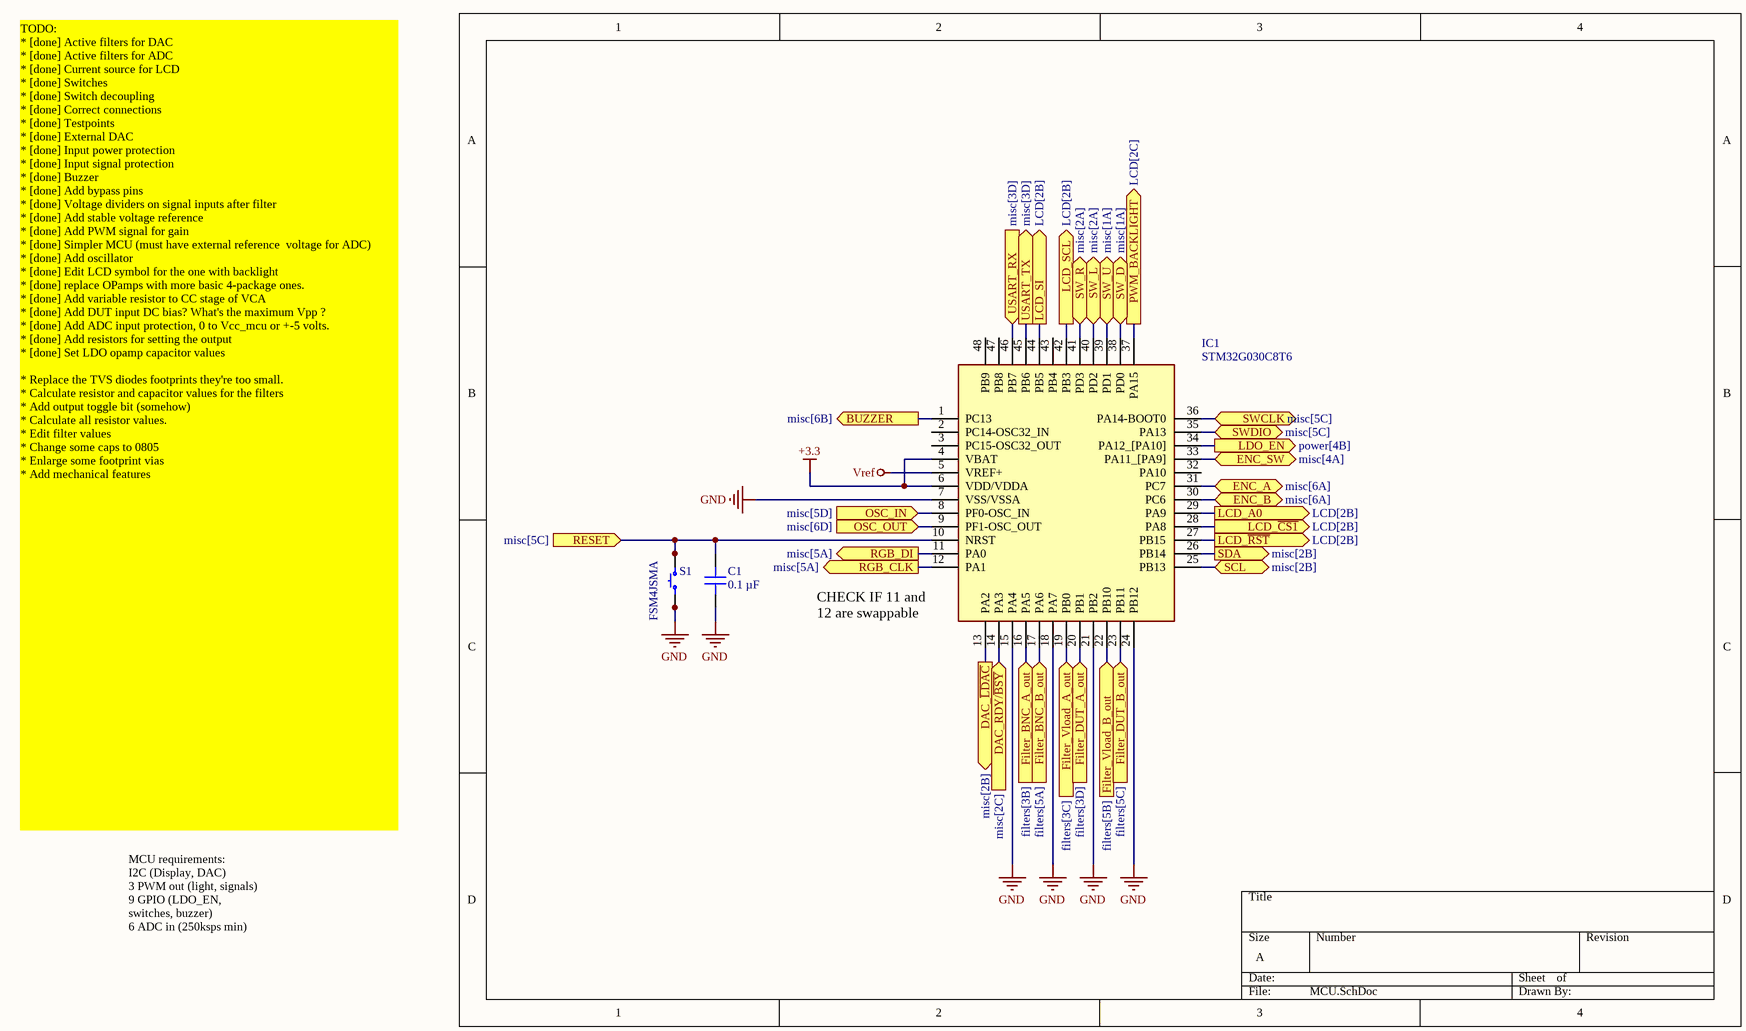
[diagram p2: MCU.SchDoc]

### Parts
C1  0.1 µF  [CAP 1206_3216 - 0.8MM]
IC1  STM32G030C8T6  [QFP50P900X900X160-48N]
S1  FSM4JSMA  [TE FSM4JSMA]

### Ports
BUZZER (out, see misc[6B]), DAC_RDY/~{BSY} (in, see misc[2C]), DAC_~{LDAC} (out, see misc[2B]), ENC_A (bidir, see misc[6A]), ENC_B (bidir, see misc[6A]), ENC_SW (bidir, see misc[4A]), Filter_BNC_A_out (in, see filters[3B]), Filter_BNC_B_out (in, see filters[5A]), Filter_DUT_A_out (in, see filters[3D]), Filter_DUT_B_out (in, see filters[5C]), Filter_Vload_A_out (in, see filters[3C]), Filter_Vload_B_out (in, see filters[5B]), LCD_A0 (out, see LCD[2B]), LCD_SCL (out, see LCD[2B]), LCD_SI (out, see LCD[2B]), LCD_~{CS1} (out, see LCD[2B]), LCD_~{RST} (out, see LCD[2B]), LDO_EN (out, see power[4B]), OSC_IN (in, see misc[5D]), OSC_OUT (in, see misc[6D]), PWM_BACKLIGHT (out, see LCD[2C]), RESET (in, see misc[5C]), RGB_CLK (out, see misc[5A]), RGB_DI (out, see misc[5A]), SCL (bidir, see misc[2B]), SDA (out, see misc[2B]), SW_D (bidir, see misc[1A]), SW_L (bidir, see misc[2A]), SW_R (bidir, see misc[2A]), SW_U (bidir, see misc[1A]), SWCLK (bidir, see misc[5C]), SWDIO (bidir, see misc[5C]), USART_RX (in, see misc[3D]), USART_TX (out, see misc[3D])

### Nets
+3.3: IC1.4(VBAT) IC1.6(VDD/VDDA)
GND: C1.1 IC1.7(VSS/VSSA) IC1.15(PA4) IC1.18(PA7) IC1.21(PB2) IC1.24(PB12) S1.1 S1.2
Vref: IC1.5(VREF+)
LCD~{_CS}1: IC1.28(PA8) ; port LCD_~{CS1}
LCD~{_RS}T: IC1.27(PB15) ; port LCD_~{RST}
LCD_A0: IC1.29(PA9) ; port LCD_A0
LCD_SCL: IC1.42(PB3) ; port LCD_SCL
LCD_SI: IC1.44(PB5) ; port LCD_SI
NetC1_2: C1.2 IC1.10(NRST) S1.3 S1.4 ; port RESET
NetC2_2: IC1.30(PC6) ; port ENC_B
NetC3_2: IC1.31(PC7) ; port ENC_A
NetC6_1: IC1.8(PF0-OSC_IN) ; port OSC_IN
NetC7_2: IC1.9(PF1-OSC_OUT) ; port OSC_OUT
NetC8_1: IC1.17(PA6) ; port Filter_BNC_B_out
NetC10_1: IC1.16(PA5) ; port Filter_BNC_A_out
NetC12_1: IC1.22(PB10) ; port Filter_Vload_B_out
NetC14_1: IC1.19(PB0) ; port Filter_Vload_A_out
NetC16_1: IC1.23(PB11) ; port Filter_DUT_B_out
NetC18_1: IC1.20(PB1) ; port Filter_DUT_A_out
NetC44_2: IC1.38(PD0) ; port SW_D
NetC45_2: IC1.39(PD1) ; port SW_U
NetC46_2: IC1.41(PD3) ; port SW_R
NetC47_2: IC1.40(PD2) ; port SW_L
NetC48_2: IC1.33(PA11_[PA9]) ; port ENC_SW
NetIC1_1: IC1.1(PC13) ; port BUZZER
NetIC1_11: IC1.11(PA0) ; port RGB_DI
NetIC1_12: IC1.12(PA1) ; port RGB_CLK
NetIC1_13: IC1.13(PA2) ; port DAC_~{LDAC}
NetIC1_14: IC1.14(PA3) ; port DAC_RDY/~{BSY}
NetIC1_25: IC1.25(PB13) ; port SCL
NetIC1_26: IC1.26(PB14) ; port SDA
NetIC1_34: IC1.34(PA12_[PA10]) ; port LDO_EN
NetIC1_35: IC1.35(PA13) ; port SWDIO
NetIC1_36: IC1.36(PA14-BOOT0) ; port SWCLK
NetIC1_37: IC1.37(PA15) ; port PWM_BACKLIGHT
NetIC1_45: IC1.45(PB6) ; port USART_TX
NetIC1_46: IC1.46(PB7) ; port USART_RX

Not connected (* = marked no-connect by the designer): IC1 2(PC14-OSC32_IN) 3(PC15-OSC32_OUT) 32(PA10) 43(PB4) 47(PB8) 48(PB9)

### Notes on the sheet
- (near IC1) CHECK IF 11 and 12 are swappable
- TODO:
  * [done] Active filters for DAC
  * [done] Active filters for ADC
  * [done] Current source for LCD
  * [done] Switches
  * [done] Switch decoupling
  * [done] Correct connections
  * [done] Testpoints
  * [done] External DAC
  * [done] Input power protection
  * [done] Input signal protection
  * [done] Buzzer
  * [done] Add bypass pins
  * [done] Voltage dividers on signal inputs after filter
  * [done] Add stable voltage reference
  * [done] Add PWM signal for gain
  * [done] Simpler MCU (must have external reference  voltage for ADC)
  * [done] Add oscillator
  * [done] Edit LCD symbol for the one with backlight
  * [done] replace OPamps with more basic 4-package ones.
  * [done] Add variable resistor to CC stage of VCA
  * [done] Add DUT input DC bias? What's the maximum Vpp ?
  * [done] Add ADC input protection, 0 to Vcc_mcu or +-5 volts.
  * [done] Add resistors for setting the output
  * [done] Set LDO opamp capacitor values
  * Replace the TVS diodes footprints they're too small.
  * Calculate resistor and capacitor values for the filters
  * Add output toggle bit (somehow)
  * Calculate all resistor values.
  * Edit filter values
  * Change some caps to 0805
  * Enlarge some footprint vias
  * Add mechanical features
- MCU requirements:
  I2C (Display, DAC)
  3 PWM out (light, signals)
  9 GPIO (LDO_EN, switches, buzzer)
  6 ADC in (250ksps min)

### Library data of the parts
C1 = 885012208087: as C8 on sheet filters; Part Number: 885012208087; Capacitance: 0.1 µF; Applications: General Purpose; componentlink1description: Datasheet; componentlink1url: https://katalog.we-online.de/pbs/datasheet/885012208087.pdf; componentlink2description: DigiKey Link; componentlink2url: https://www.digikey.com/en/products/detail/würth-elektronik/885012208087/5453982; Device Package: 1206 (3216 Metric); lastupdated: 6/4/2024 19:10:27; Lifecycle Status: Active; Minimum Order: 1; Mounting Type: Surface Mount, MLCC; Operating Temperature: -55°C ~ 125°C; Package / Case: 1206 (3216 Metric); packaging: TapeAndReel; partid: 20879; Part Status: Active; price: 0.06; series: WCAP-CSGP; Size / Dimension: 0.126" L x 0.063" W (3.20mm x 1.60mm); Supplier 1: DigiKey; Supplier Part Number 1: 732-8127-1-ND; Temperature Coefficient: X7R; Thickness (Max): 0.035" (0.90mm); value: 0.1 µF; Voltage - Rated: 50V
IC1 = STM32G030C8T6: Integrated Circuit; Manufacturer_Name: STMicroelectronics; Datasheet Link: https://componentsearchengine.com/Datasheets/1/STM32G030C8T6.pdf; Height: 1.6mm; Manufacturer_Part_Number: STM32G030C8T6; Mouser Part Number: 511-STM32G030C8T6; Mouser Price/Stock: https://www.mouser.co.uk/ProductDetail/STMicroelectronics/STM32G030C8T6?qs=uwxL4vQweFMKBA8wRRkiWA%3D%3D; Arrow Part Number: STM32G030C8T6; Arrow Price/Stock: https://www.arrow.com/en/products/stm32g030c8t6/stmicroelectronics?utm_currency=USD&region=nac
S1 = FSM4JSMA: SWITCH TACTILE SPST-NO 0.05A 24V; Manufacturer: TE Connectivity ALCOSWITCH Switches; Actuator Height off PCB, Vertical: 5.00mm; Actuator Orientation: Top Actuated; Actuator Type: Standard; Contact Rating @ Voltage: 0.05A @ 24VDC; Illumination: Non-Illuminated; Operating Force: 160gf; Outline: 6.00mm x 6.00mm; Switch Function: Off-Mom; Part Number: FSM4JSMA; Circuit: SPST-NO; ComponentLink1Description: Datasheet; ComponentLink1URL: https://www.te.com/commerce/DocumentDelivery/DDEController?Action=srchrtrv&DocNm=1308111-1_SWITCHES_CORE_PROGRAM_CATALOG&DocType=CS&DocLang=English; ComponentLink2Description: DigiKey Link; ComponentLink2URL: https://www.digikey.com/en/products/detail/te-connectivity-alcoswitch-switches/FSM4JSMA/525821; LastUpdated: 6/3/2024 20:19:31; Lifecycle Status: Active; Minimum Order: 1; Mounting Type: Surface Mount; Operating Temperature: -35°C ~ 85°C; Packaging: Bulk; Part Status: Active; Price: 0.14; Series: FSMJSMA; Supplier 1: DigiKey; Supplier Part Number 1: 450-1129-ND; Termination Style: Gull Wing